# EAGLE design LowLevelv3_1 (EAGLE 9.6.2)

## Sheet 1 of 3
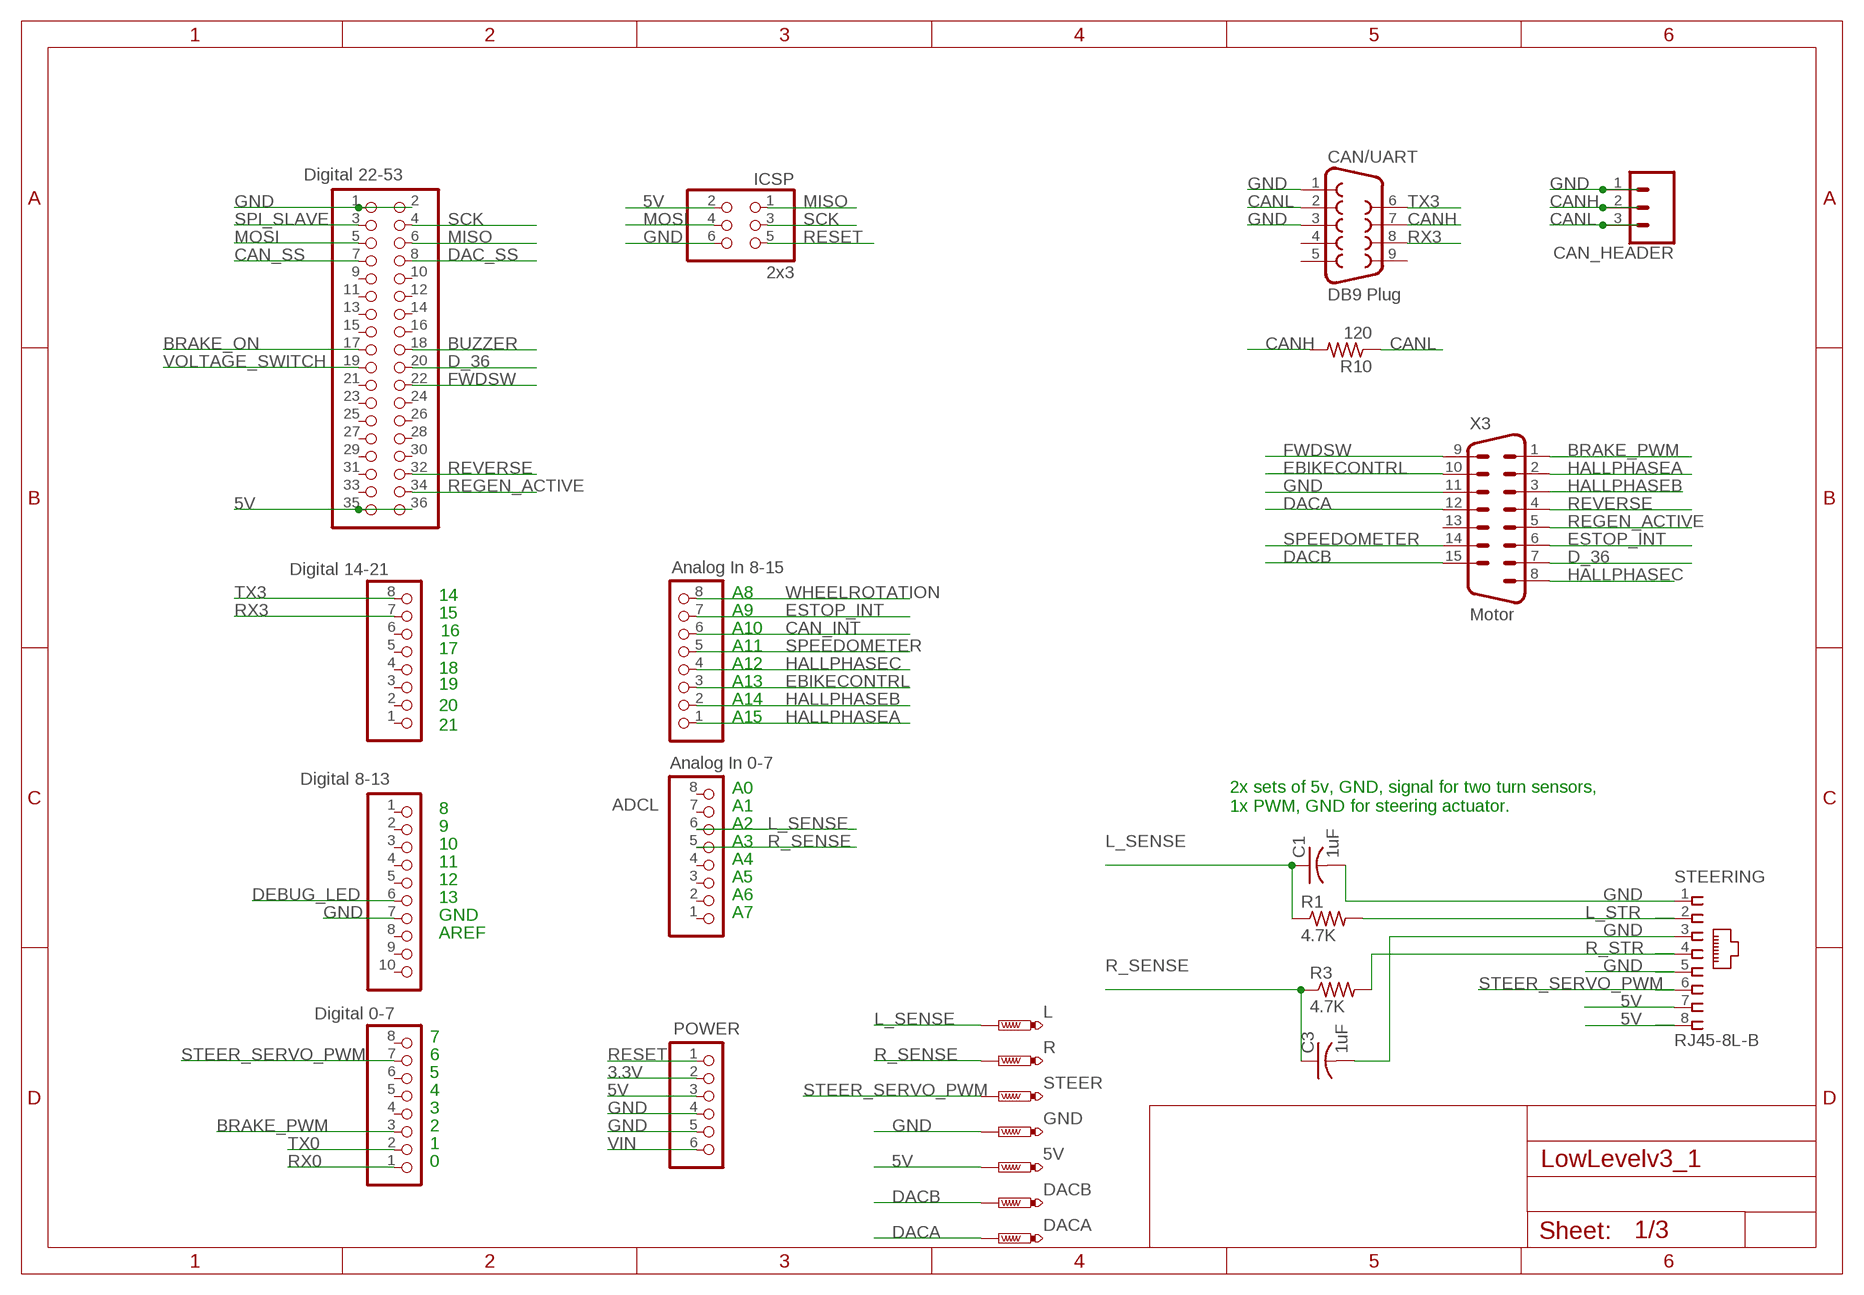
[diagram p0: schematic, sheet 1]

### Parts
5V  PTR1PAD1-17  [P1-17]
ADCH  Analog In 8-15  PINHD-1X8  [1X08]
ADCL  Analog In 0-7  PINHD-1X8  [1X08]
C1  1uF  C-USC1206  [C1206]
C3  1uF  C-USC1206  [C1206]
CAN/UART  DB9 Plug  DB9FEMALE  [DB9]
CAN_HEADER  CONN_03-SCREW-5MM  [SCREWTERMINAL-5MM-3]
DACA  PTR1PAD1-17  [P1-17]
DACB  PTR1PAD1-17  [P1-17]
DIGITAL_0-7  Digital 0-7  PINHD-1X8  [1X08]
DIGITAL_8-13  Digital 8-13  PINHD-1X10  [1X10]
DIGITAL_14-21  Digital 14-21  PINHD-1X8  [1X08]
GND  PTR1PAD1-17  [P1-17]
ICSP  2x3  PINHD-2X3  [2X03]
L  PTR1PAD1-17  [P1-17]
MEGA_EXPANSION  Digital 22-53  PINHEAD_PINHD-2X18  [PINHEAD_2X18]
POWER  PINHD-1X6  [1X06]
R  PTR1PAD1-17  [P1-17]
R1  4.7K  R-US_R1206  [R1206]
R3  4.7K  R-US_R1206  [R1206]
R10  120  R-US_R1206  [R1206]
STEER  PTR1PAD1-17  [P1-17]
STEERING  RJ45-8L-B  [RJ45-NO-SHIELD]
X3  Motor  M15-182  [182-015-MALE]

### Nets
3.3V [Power]: POWER.2
5V [Power]: 5V.TP ICSP.2 MEGA_EXPANSION.35 MEGA_EXPANSION.36 POWER.3 STEERING.7 STEERING.8 ; also sheet 2,3
BRAKE_ON: MEGA_EXPANSION.17 ; also sheet 3
BRAKE_PWM: DIGITAL_0-7.3 X3.1
BUZZER: MEGA_EXPANSION.18 ; also sheet 2
CAN_INT: ADCH.6 ; also sheet 2
CAN_SS [SPI_Signals]: MEGA_EXPANSION.7 ; also sheet 2
CANH: CAN/UART.7 CAN_HEADER.2 R10.2 ; also sheet 2
CANL: CAN/UART.2 CAN_HEADER.3 R10.1 ; also sheet 2
D_36: MEGA_EXPANSION.20 X3.7
DAC_SS [SPI_Signals]: MEGA_EXPANSION.8 ; also sheet 2
DACA: DACA.TP X3.12 ; also sheet 2
DACB: DACB.TP X3.15 ; also sheet 2
DEBUG_LED: DIGITAL_8-13.6 ; also sheet 2
EBIKECONTRL: ADCH.3 X3.10
ESTOP_INT: ADCH.7 X3.6 ; also sheet 2
FWDSW: MEGA_EXPANSION.22 X3.9
GND [Power]: C1.2 C3.2 CAN/UART.1 CAN/UART.3 CAN_HEADER.1 DIGITAL_8-13.7 GND.TP ICSP.6 MEGA_EXPANSION.1 MEGA_EXPANSION.2 POWER.4 POWER.5 STEERING.1 STEERING.3 STEERING.5 X3.11 ; also sheet 2,3
HALLPHASEA: ADCH.1 X3.2
HALLPHASEB: ADCH.2 X3.3
HALLPHASEC: ADCH.4 X3.8
L_SENSE: ADCL.6 C1.1 L.TP R1.1
L_STR: R1.2 STEERING.2
MISO [SPI_Signals]: ICSP.1 MEGA_EXPANSION.6 ; also sheet 2
MOSI [SPI_Signals]: ICSP.4 MEGA_EXPANSION.5 ; also sheet 2
R_SENSE: ADCL.5 C3.1 R3.1 R.TP
R_STR: R3.2 STEERING.4
REGEN_ACTIVE: MEGA_EXPANSION.34 X3.5
RESET: ICSP.5 POWER.1 ; also sheet 2
REVERSE: MEGA_EXPANSION.32 X3.4
RX0: DIGITAL_0-7.1
RX3: CAN/UART.8 DIGITAL_14-21.7
SCK [SPI_Signals]: ICSP.3 MEGA_EXPANSION.4 ; also sheet 2
SPEEDOMETER: ADCH.5 X3.14
SPI_SLAVE [SPI_Signals]: MEGA_EXPANSION.3
STEER_SERVO_PWM: DIGITAL_0-7.7 STEER.TP STEERING.6
TX0: DIGITAL_0-7.2
TX3: CAN/UART.6 DIGITAL_14-21.8
VIN: POWER.6
VOLTAGE_SWITCH: MEGA_EXPANSION.19 ; also sheet 3
WHEELROTATION: ADCH.8 ; also sheet 2
Unconnected: ADCL.1 ADCL.2 ADCL.3 ADCL.4 ADCL.7 ADCL.8 CAN/UART.4 CAN/UART.5 CAN/UART.9 DIGITAL_0-7.4 DIGITAL_0-7.5 DIGITAL_0-7.6 DIGITAL_0-7.8 DIGITAL_8-13.1 DIGITAL_8-13.2 DIGITAL_8-13.3 DIGITAL_8-13.4 DIGITAL_8-13.5 DIGITAL_8-13.8 DIGITAL_8-13.9 DIGITAL_8-13.10 DIGITAL_14-21.1 DIGITAL_14-21.2 DIGITAL_14-21.3 DIGITAL_14-21.4 DIGITAL_14-21.5 DIGITAL_14-21.6 MEGA_EXPANSION.9 MEGA_EXPANSION.10 MEGA_EXPANSION.11 MEGA_EXPANSION.12 MEGA_EXPANSION.13 MEGA_EXPANSION.14 MEGA_EXPANSION.15 MEGA_EXPANSION.16 MEGA_EXPANSION.21 MEGA_EXPANSION.23 MEGA_EXPANSION.24 MEGA_EXPANSION.25 MEGA_EXPANSION.26 MEGA_EXPANSION.27 MEGA_EXPANSION.28 MEGA_EXPANSION.29 MEGA_EXPANSION.30 MEGA_EXPANSION.31 MEGA_EXPANSION.33 X3.13

### Notes on the sheet
- 14 | A8
- 15 | A9
- 16 | A10
- 17 | A11
- 18 | A12
- 19 | A13
- A14
- 20
- A15
- 21
- A0
- A1
- 2x sets of 5v, GND, signal for two turn sensors,
  1x PWM, GND for steering actuator.
- 8
- 9 | A2
- 10 | A3
- 11 | A4
- 12 | A5
- 13 | A6
- GND | A7
- AREF
- 7
- 6
- 5
- 4
- 3
- 2
- 1
- 0

## Sheet 2 of 3
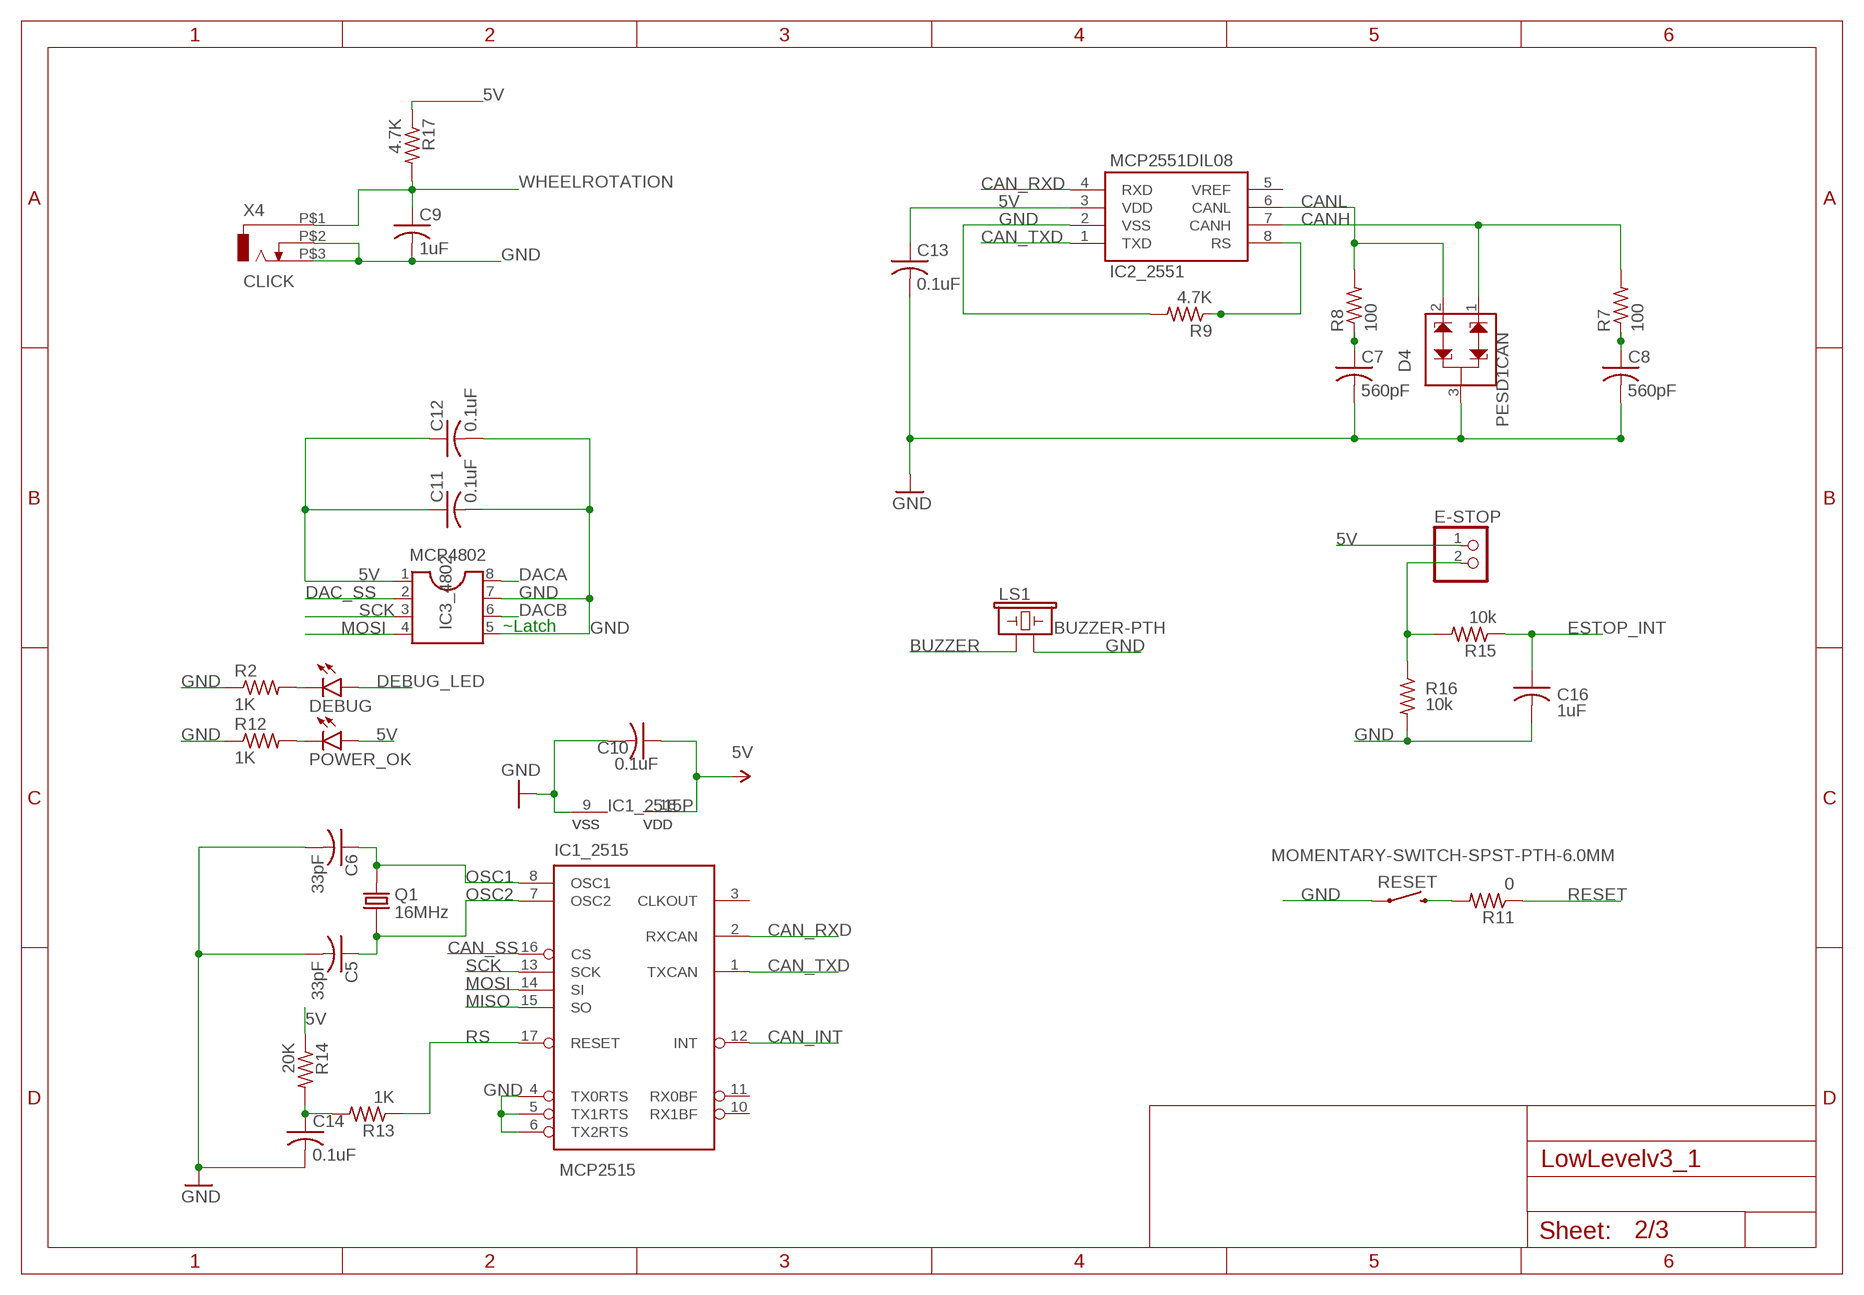
[diagram p1: schematic, sheet 2]

### Parts
C5  33pF  C-USC1206  [C1206]
C6  33pF  C-USC1206  [C1206]
C7  560pF  C-USC1206  [C1206]
C8  560pF  C-USC1206  [C1206]
C9  1uF  C-USC1206  [C1206]
C10  0.1uF  C-USC1206  [C1206]
C11  0.1uF  C-USC1206  [C1206]
C12  0.1uF  C-USC1206  [C1206]
C13  0.1uF  C-USC1206  [C1206]
C14  0.1uF  C-USC1206  [C1206]
C16  1uF  C-USC1206  [C1206]
D4  PESD1CAN  [SPARKFUN-DISCRETESEMI_SOT23-3]
DEBUG  LED3MM  [LED3MM]
E-STOP  PINHD-1X2  [1X02]
IC1_2515  MCP2515  MCP2515(MCP2510)P  [DIP18]
IC2_2551  MCP2551DIL08  [IC-PACKAGE_DIL08]
IC3_4802  MCP4802  DIL8  [DIL08]
LS1  BUZZER-PTH  [BUZZER-12MM]
POWER_OK  LED3MM  [LED3MM]
Q1  16MHz  ECS-160-20-46X  [XTAL_ECS-160-20-46X]
R2  1K  R-US_R1206  [R1206]
R7  100  R-US_R1206  [R1206]
R8  100  R-US_R1206  [R1206]
R9  4.7K  R-US_R1206  [R1206]
R11  0  R-US_R1206  [R1206]
R12  1K  R-US_R1206  [R1206]
R13  1K  R-US_R1206  [R1206]
R14  20K  R-US_R1206  [R1206]
R15  10k  R-US_R1206  [R1206]
R16  10k  R-US_R1206  [R1206]
R17  4.7K  R-US_R1206  [R1206]
RESET  MOMENTARY-SWITCH-SPST-PTH-6.0MM  [TACTILE_SWITCH_PTH_6.0MM]
X4  CLICK  ODO_JACK  [ODO_JACK]

### Nets
5V [Power]: C10.1 C11.1 C12.1 C13.1 E-STOP.1 IC1_2515.18(VDD) IC2_2551.3(VDD) IC3_4802.1 POWER_OK.A R14.1 R17.1 ; also sheet 1,3
BUZZER: LS1.+ ; also sheet 1
CAN_INT: IC1_2515.12(INT) ; also sheet 1
CAN_RXD: IC1_2515.2(RXCAN) IC2_2551.4(RXD)
CAN_SS [SPI_Signals]: IC1_2515.16(CS) ; also sheet 1
CAN_TXD: IC1_2515.1(TXCAN) IC2_2551.1(TXD)
CANH: D4.1 IC2_2551.7(CANH) R7.2 ; also sheet 1
CANL: D4.2 IC2_2551.6(CANL) R8.2 ; also sheet 1
DAC_SS [SPI_Signals]: IC3_4802.2 ; also sheet 1
DACA: IC3_4802.8 ; also sheet 1
DACB: IC3_4802.6 ; also sheet 1
DEBUG_LED: DEBUG.A ; also sheet 1
ESTOP_INT: C16.1 R15.1 ; also sheet 1
GND [Power]: C5.2 C6.2 C7.2 C8.2 C9.2 C10.2 C11.2 C12.2 C13.2 C14.2 C16.2 D4.3 IC1_2515.4(TX0RTS) IC1_2515.5(TX1RTS) IC1_2515.6(TX2RTS) IC1_2515.9(VSS) IC2_2551.2(VSS) IC3_4802.5 IC3_4802.7 LS1.- R2.1 R9.2 R12.1 R16.2 RESET.1 X4.P$2 X4.P$3 ; also sheet 1,3
MISO [SPI_Signals]: IC1_2515.15(SO) ; also sheet 1
MOSI [SPI_Signals]: IC1_2515.14(SI) IC3_4802.4 ; also sheet 1
N$1: R11.2 RESET.3
N$4: C14.1 R13.2 R14.2
N$5: DEBUG.K(C) R2.2
N$8: E-STOP.2 R15.2 R16.1
N$9: C7.1 R8.1
N$10: C8.1 R7.1
N$11: POWER_OK.K(C) R12.2
N$14: IC2_2551.8(RS) R9.1
OSC1 [Oscillator]: C6.1 IC1_2515.8(OSC1) Q1.2
OSC2 [Oscillator]: C5.1 IC1_2515.7(OSC2) Q1.1
RESET: R11.1 ; also sheet 1
RS: IC1_2515.17(RESET) R13.1
SCK [SPI_Signals]: IC1_2515.13(SCK) IC3_4802.3 ; also sheet 1
WHEELROTATION: C9.1 R17.2 X4.P$1 ; also sheet 1
Unconnected: IC1_2515.3(CLKOUT) IC1_2515.10(RX1BF) IC1_2515.11(RX0BF) IC2_2551.5(VREF)

### Notes on the sheet
- ~Latch

## Sheet 3 of 3
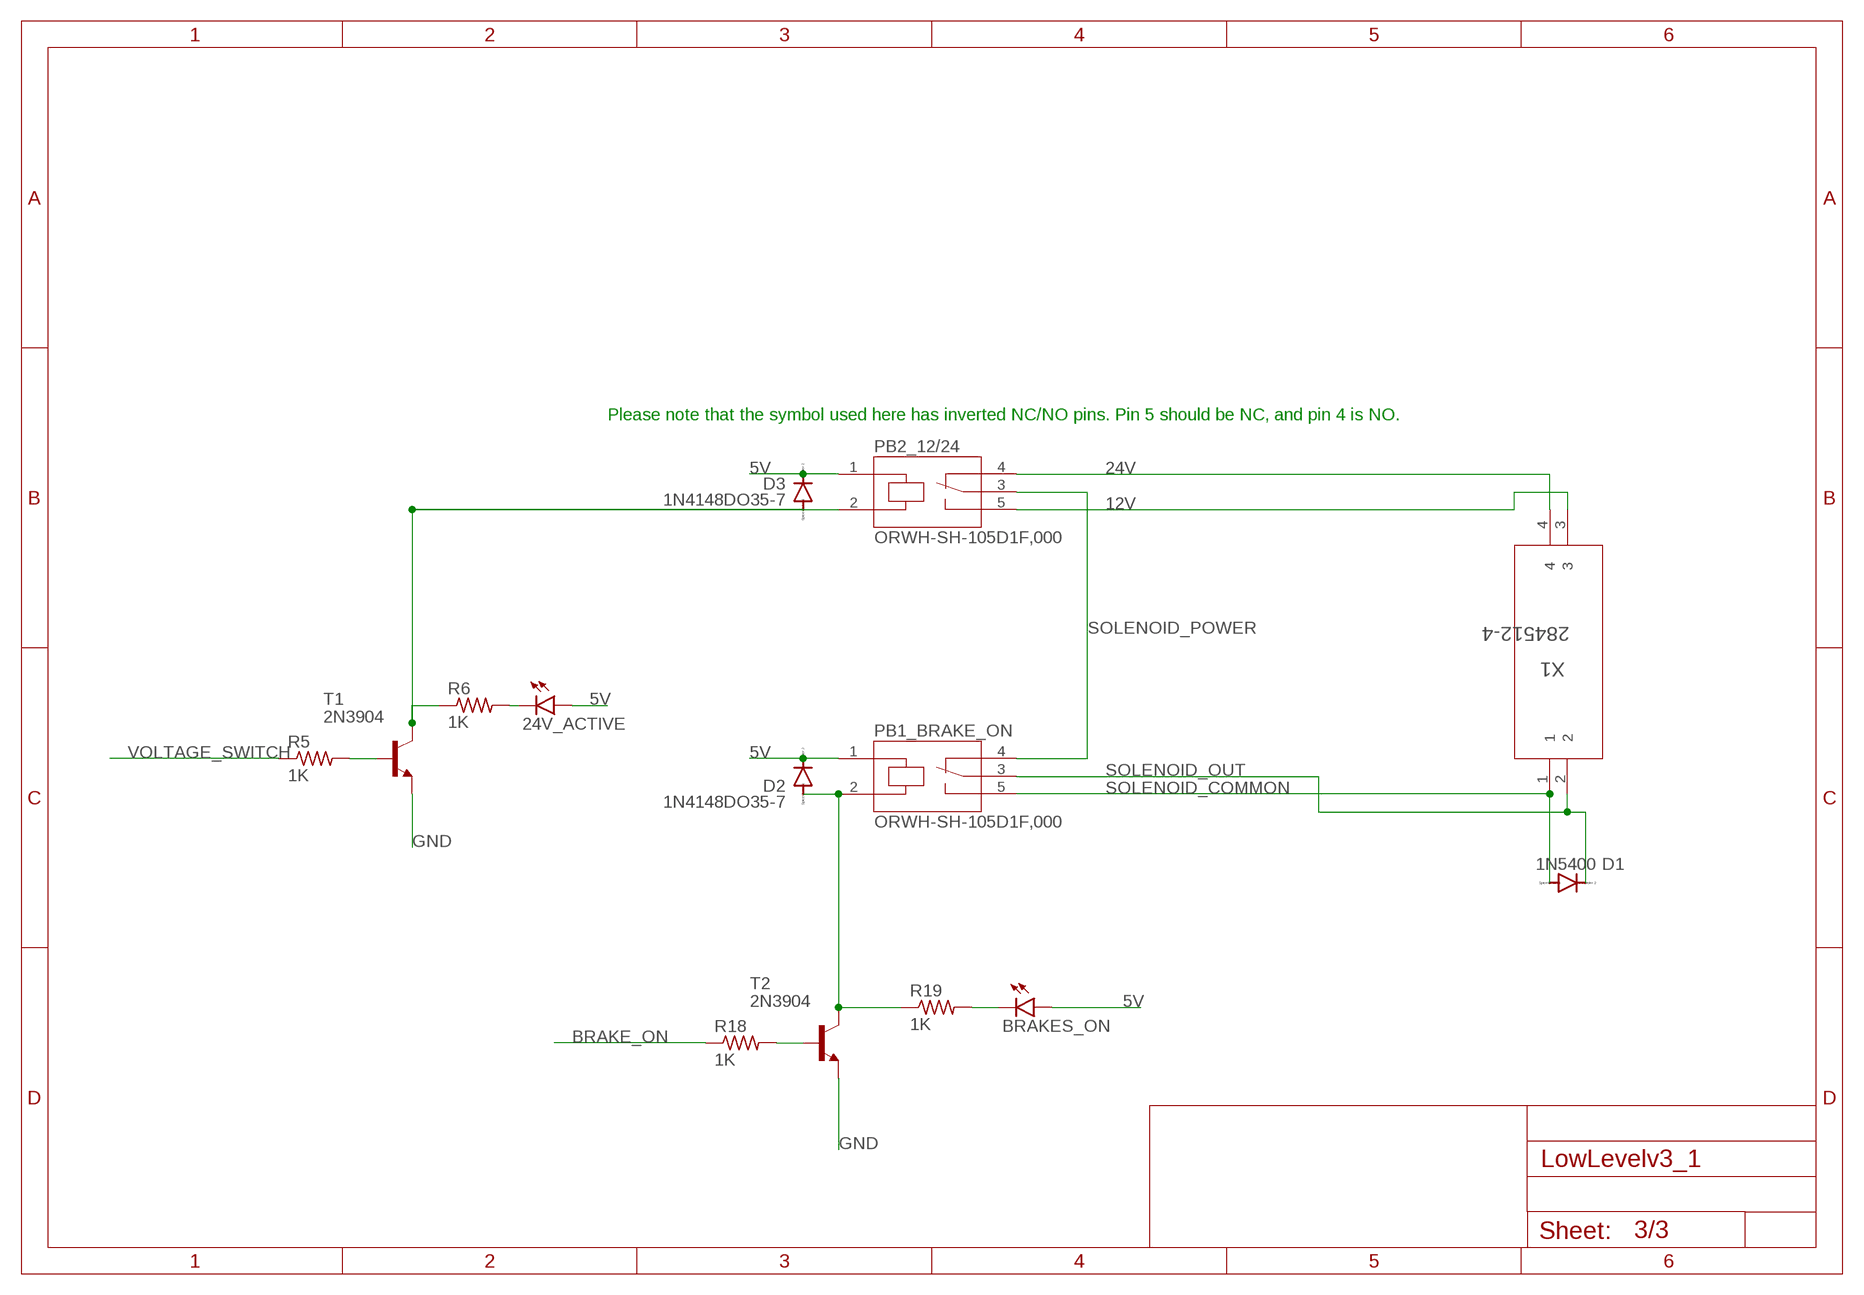
[diagram p2: schematic, sheet 3]

### Parts
24V_ACTIVE  LED3MM  [LED3MM]
BRAKES_ON  LED3MM  [LED3MM]
D1  1N5400  [DO201-15]
D2  1N4148DO35-7  [DO35-7]
D3  1N4148DO35-7  [DO35-7]
PB1_BRAKE_ON  ORWH-SH-105D1F,000  [TE_ORWH-SH-105D1F,000]
PB2_12/24  ORWH-SH-105D1F,000  [TE_ORWH-SH-105D1F,000]
R5  1K  R-US_R1206  [R1206]
R6  1K  R-US_R1206  [R1206]
R18  1K  R-US_R1206  [R1206]
R19  1K  R-US_R1206  [R1206]
T1  2N3904  [TO92]
T2  2N3904  [TO92]
X1  284512-4  [284512-4]

### Nets
5V [Power]: 24V_ACTIVE.A BRAKES_ON.A D2.C D3.C PB1_BRAKE_ON.1(C1) PB2_12/24.1(C1) ; also sheet 1,2
12V [High Current]: PB2_12/24.5(NO) X1.3
24V [High Current]: PB2_12/24.4(NC) X1.4
BRAKE_ON: R18.1 ; also sheet 1
GND [Power]: T1.3(E) T2.3(E) ; also sheet 1,2
N$2: R5.2 T1.2(B)
N$3: D3.A PB2_12/24.2(C2) R6.1 T1.1(C)
N$6: 24V_ACTIVE.K(C) R6.2
N$7: R18.2 T2.2(B)
N$12: D2.A PB1_BRAKE_ON.2(C2) R19.1 T2.1(C)
N$13: BRAKES_ON.K(C) R19.2
SOLENOID_COMMON [High Current]: D1.A PB1_BRAKE_ON.5(NO) X1.1
SOLENOID_OUT [High Current]: D1.C PB1_BRAKE_ON.3(C) X1.2
SOLENOID_POWER [High Current]: PB1_BRAKE_ON.4(NC) PB2_12/24.3(C)
VOLTAGE_SWITCH: R5.1 ; also sheet 1

### Notes on the sheet
- Please note that the symbol used here has inverted NC/NO pins. Pin 5 should be NC, and pin 4 is NO.

## Library data of the parts
5V DACA DACB GND L R STEER = testpad:PTR1: TEST PIN
24V_ACTIVE BRAKES_ON DEBUG POWER_OK = led:LED: LED OSRAM: - CHIPLED LG R971, LG N971, LY N971, LG Q971, LY Q971, LO R971, LY R971 LH N974, LH R974 LS Q976, LO Q976, LY Q976 LO Q996 - Hyper CHIPLED LW Q18S LB Q993, LB Q99A, LB R99A - SideLED LS A670, LO A670, LY A670, LG A670, LP A670 LB A673, LV A673, LT A673, LW A673 LH A674 LY A675 LS A676, LA A676, LO A676, LY A676, LW A676 LS A679, LY A679, LG A679 - Hyper Micro SIDELED® LS Y876, LA Y876, LO Y876, LY Y876 LT Y87S - SmartLED LW L88C, LW L88S LB L89C, LB L89S, LG L890 LS L89K, LO L89K, LY L89K LS L896, LA L896, LO L896, LY L896 - TOPLED LS T670, LO T670, LY T670, LG T670, LP T670 LSG T670, LSP T670, LSY T670, LOP T670, LYG T670 LG T671, LOG T671, LSG T671 LB T673, LV T673, LT T673, LW T673 LH T674 LS T676, LA T676, LO T676, LY T676, LB T676, LH T676, LSB T676, LW T676 LB T67C, LV T67C, LT T67C, LS T67K, LO T67K, LY T67K, LW E67C LS E67B, LA E67B, LO E67B, LY E67B, LB E67C, LV E67C, LT E67C LW T67C LS T679, LY T679, LG T679 LS T770, LO T770, LY T770, LG T770, LP T770 LB T773, LV T773, LT T773, LW T773 LH T774 LS E675, LA E675, LY E675, LS T675 LS T776, LA T776, LO T776, LY T776, LB T776 LHGB T686 LT T68C, LB T68C - Hyper Mini TOPLED® LB M676 - Mini TOPLED Santana® LG M470 LS M47K, LO M47K, LY M47K Source: http://www.osram.convergy.de LUXEON: - LUMILED® LXK2-PW12-R00, LXK2-PW12-S00, LXK2-PW14-U00, LXK2-PW14-V00 LXK2-PM12-R00, LXK2-PM12-S00, LXK2-PM14-U00 LXK2-PE12-Q00, LXK2-PE12-R00, LXK2-PE12-S00, LXK2-PE14-T00, LXK2-PE14-U00 LXK2-PB12-K00, LXK2-PB12-L00, LXK2-PB12-M00, LXK2-PB14-N00, LXK2-PB14-P00, LXK2-PB14-Q00 LXK2-PR12-L00, LXK2-PR12-M00, LXK2-PR14-Q00, LXK2-PR14-R00 LXK2-PD12-Q00, LXK2-PD12-R00, LXK2-PD12-S00 LXK2-PH12-R00, LXK2-PH12-S00 LXK2-PL12-P00, LXK2-PL12-Q00, LXK2-PL12-R00 Source: www.luxeon.com KINGBRIGHT: KA-3528ASYC Source: www.kingbright.com
ADCH ADCL DIGITAL_0-7 DIGITAL_14-21 = pinhead:PINHD-1X8: PIN HEADER
C1 C3 C5-C14 C16 = resistor:C-US: CAPACITOR, American symbol
CAN/UART = SparkFun-Connectors:DB9: DB9 Connector Standard DB9 (D-Sub 9) serial connector. Can be used for CAN bus as well as RS485 and RS232. Footprint production proven. Here is the female version connector we sell at SparkFun: 9 Pin Female Serial Connector - PCB Mount <https://www.sparkfun.com/products/429> (PRT-00429) This connector has been used on the following SparkFun products: SparkFun RS232 Shifter - SMD <https://www.sparkfun.com/products/449> (PRT-00449) SparkFun RS232 Shifter SMD (No DB9) <https://www.sparkfun.com/products/8780> (PRT-08780); PROD_ID: CONN-08194; SPICEPREFIX: X
CAN_HEADER = SparkFun-Connectors:CONN_03: Multi connection point. Often used as Generic Header-pin footprint for 0.1 inch spaced/style header connections On any of the 0.1 inch spaced packages, you can populate with these: Break Away Headers - Straight <https://www.sparkfun.com/products/116> (PRT-00116) Break Away Male Headers - Right Angle <https://www.sparkfun.com/products/553> (PRT-00553) Female Headers <https://www.sparkfun.com/products/115> (PRT-00115) Break Away Headers - Machine Pin <https://www.sparkfun.com/products/117> (PRT-00117) Break Away Female Headers - Swiss Machine Pin <https://www.sparkfun.com/products/743> (PRT-00743) Stackable Header - 3 Pin (Female, 0.1") <https://www.sparkfun.com/products/13875> (PRT-13875) For SCREWTERMINALS and SPRING TERMINALS visit here: Screw Terimnals on SparkFun.com <https://www.sparkfun.com/search/results?term=Screw+Terminals> (5mm/3.5mm/2.54mm spacing) This device is also useful as a general connection point to wire up your design to another part of your project. Our various solder wires solder well into these plated through hole pads. Hook-Up Wire - Assortment (Stranded, 22 AWG) <https://www.sparkfun.com/products/11375> (PRT-11375) Hook-Up Wire - Assortment (Solid Core, 22 AWG) <https://www.sparkfun.com/products/11367> (PRT-11367) View the entire wire category on our website here <https://www.sparkfun.com/categories/141> Special notes: Molex polarized connector foot print use with SKU : PRT-08232 with associated crimp pins and housings.; PROD_ID: CONN-10134; SF_SKU: PRT-08433
D1 = diode:1N5400: DIODE standard rectifier, 3 A, 50 V (Motorola)
D2 D3 = diode:1N4148: DIODE high speed (Philips)
D4 = elcanoParts:PESD1CAN: CAN bus ESD protection diode PESD1CAN is used to protect two CAN bus lines from ESD. Link to datasheet <http://www.nxp.com/documents/data_sheet/PESD1CAN-U.pdf> SparkFun Products: SparkFun CAN-BUS Shield <https://www.sparkfun.com/products/13262> '; SPICEPREFIX: J
DIGITAL_8-13 = pinhead:PINHD-1X10: PIN HEADER
E-STOP = pinhead:PINHD-1X2: PIN HEADER
IC1_2515 = SparkFun-IC-Comms:MCP2515(MCP2510): CAN controller with SPI interface The MCP2515 controller supercedes the MCP2510 while addressing all errata associated with it. The two devices are pin compatible, either can be used with this device. 18-pin package SOIC Simple SPI interface to any MCU. One-shot mode ensures message transmission is attempted only once Databyte filtering Start-of-Frame (SOF) output Low-power CMOS Technology Datasheet <http://www.sparkfun.com/datasheets/DevTools/Arduino/MCP2515.pdf> SparkFun Products CAN-BUS Shield <https://www.sparkfun.com/products/13262> (DEV-13262); PROD_ID: NA-XXXXX; SPICEPREFIX: X
IC2_2551 = elcanoParts:MCP2551: CAN transceiver; SPICEPREFIX: X
IC3_4802 = ic-package:DIL8: Dual In Line / Socket
ICSP = pinhead:PINHD-2X3: PIN HEADER
LS1 = SparkFun-Electromechanical:BUZZER: Buzzer Small round buzzers that operate around the audible 2kHz range. You can use these as speakers to create simple music or user interfaces. Variant Overview: PTH - Mini Speaker - PC Mount 12mm 2.048kHz <https://www.sparkfun.com/products/7950> PTH_KIT - Mini Speaker - PC Mount 12mm 2.048kHz <https://www.sparkfun.com/products/7950> KIT simplifies soldering by adding stop mask to one side of the pads. PTH_NO_SILK - Mini Speaker - PC Mount 12mm 2.048kHz <https://www.sparkfun.com/products/7950> No silkscreen indicator of buzzer outline. PTH_KIT_NO_SILK - Mini Speaker - PC Mount 12mm 2.048kHz <https://www.sparkfun.com/products/7950> KIT package w/o silkscreen SMD - Buzzer Audio Magnetic (CCV-084B16) SMD buzzer used on, e.g. the LilyPad Buzzer <https://www.sparkfun.com/products/8463> and RFID USB Reader <https://www.sparkfun.com/products/9963>. SMD_KIT - Buzzer Audio Magnetic (CCV-084B16) SMD Buzzer with elongated pins to make soldering easier. Used on the SparkFun Simon Says - Surface Mount Soldering Kit <https://www.sparkfun.com/products/10935>.; PROD_ID: COMP-08253; SF_SKU: COM-07950
MEGA_EXPANSION = elcanoParts:PINHEAD_PINHD-2X18: PIN HEADER
PB1_BRAKE_ON PB2_12/24 = elcanoParts:ORWH-SH-105D1F,000: General Purpose Relay, ORWH Series, Power, Non Latching, SPDT, 5 VDC, 10 A; DESCRIPTION: General Purpose Relay, ORWH Series, Power, Non Latching, SPDT, 5 VDC, 10 A; DIGI-KEY_PART_NUMBER: PB2032-ND; DIGI-KEY_PURCHASE_URL: https://www.digikey.com/product-detail/en/te-connectivity-potter-brumfield-relays/ORWH-SH-105D1F,000/PB2032-ND/4925028?utm_source=snapeda&utm_medium=aggregator&utm_campaign=symbol; MF: TE; MP: ORWH-SH-105D1F,000; PACKAGE: None
POWER = pinhead:PINHD-1X6: PIN HEADER
Q1 = elcanoParts:ECS-160-20-46X: QUARTZ CRYSTAL T/H; DESCRIPTION: Crystal 16MHz ±30ppm _Tol_ ±50ppm _Stability_ 20pF FUND 50Ohm; DIGI-KEY_PART_NUMBER: XC1759-ND; DIGI-KEY_PURCHASE_URL: https://www.digikey.com/product-detail/en/ecs-inc/ECS-160-20-46X/XC1759-ND/2676589?utm_source=snapeda&utm_medium=aggregator&utm_campaign=symbol; MF: ECS Inc.; MP: ECS-160-20-46X; PACKAGE: HC46/X ECS International; SPICEPREFIX: B
R1-R3 R5-R19 = resistor:R-US_: RESISTOR, American symbol
RESET = SparkFun-Switches:MOMENTARY-SWITCH-SPST: Momentary Switch (Pushbutton) - SPST Normally-open (NO) SPST momentary switches (buttons, pushbuttons). Variants PTH-12MM - 12mm square, through-hole Momentary Pushbutton Switch - 12mm Square <https://www.sparkfun.com/products/9190> (COM-09190) PTH-6.0MM, PTH-6.0MM-KIT - 6.0mm square, through-hole Mini Pushbutton Switch <https://www.sparkfun.com/products/97> (COM-00097) KIT package intended for soldering kit's - only one side of pads' copper is exposed. PTH-RIGHT-ANGLE-KIT - Right-angle, through-hole Right Angle Tactile Button <https://www.sparkfun.com/products/10791> - Used on SparkFun BigTime Watch Kit <https://www.sparkfun.com/products/11734> SMD-12MM - 12mm square, surface-mount Tactile Button - SMD (12mm) <https://www.sparkfun.com/products/12993> (COM-12993) Used on SparkFun PicoBoard <https://www.sparkfun.com/products/11888> SMD-4.5MM - 4.5mm Square Trackball Switch Used on SparkFun Blackberry Trackballer Breakout <https://www.sparkfun.com/products/13169> SMD-4.6MMX2.8MM - 4.60mm x 2.80mm, surface mount Used on SparkFun SAMD21 Mini Breakout <https://www.sparkfun.com/products/13664> SMD-5.2MM, SMD-5.2-REDUNDANT - 5.2mm square, surface-mount Mini Pushbutton Switch - SMD <https://www.sparkfun.com/products/8720> (COM-08720) Used on Arduino Pro Mini <https://www.sparkfun.com/products/11114> REDUNDANT package connects both switch circuits together SMD-6.0X3.5MM - 6.0 x 3.5mm, surface mount Momentary Reset Switch SMD <https://www.sparkfun.com/products/8229> (COM-08229) SMD-6.2MM-TALL - 6.2mm square, surface mount Tactile Button - SMD (6mm) <https://www.sparkfun.com/products/12992> Used on SparkFun Digital Sandbox <https://www.sparkfun.com/products/12651> SMD-RIGHT-ANGLE - Right-angle, surface mount Used on SparkFun Block for Intel® Edison - Arduino <https://www.sparkfun.com/products/13036>; PROD_ID: SWCH-08441; SF_SKU: COM-00097
STEERING = elcanoParts:RJ45: CORCOM Modular RJ Jacks No Shield Source: www.tycoelectronics.com .. ENG_DS_1654001_1099_RJ_L_0507.pdf; MF: TYCO ELECTRONICS; MPN: RJ45-8L-B; OC_FARNELL: 1279843; OC_NEWARK: 52K4445
T1 T2 = transistor:2N3904: NPN TRANSISTOR
X1 = elcanoParts:284512-4; MANUFACTURER_PART_NUMBER: 2845124; VENDOR: TE Connectivity
X3 = con-subd:M15: SUB-D; OC_FARNELL: unknown; OC_NEWARK: unknown
X4 = elcanoParts:ODO_JACK

## Net classes
0 default: width 0.254 mm, drill 0.305 mm, clearance 0.254 mm
1 Power: width 0.508 mm, drill 0.305 mm, clearance 0.254 mm
2 High Current: width 0.508 mm, drill 0.305 mm, clearance 0.508 mm
3 SPI_Signals: width 0.254 mm, clearance 0.254 mm
4 Oscillator: width 0.254 mm, clearance 0.508 mm

## Board
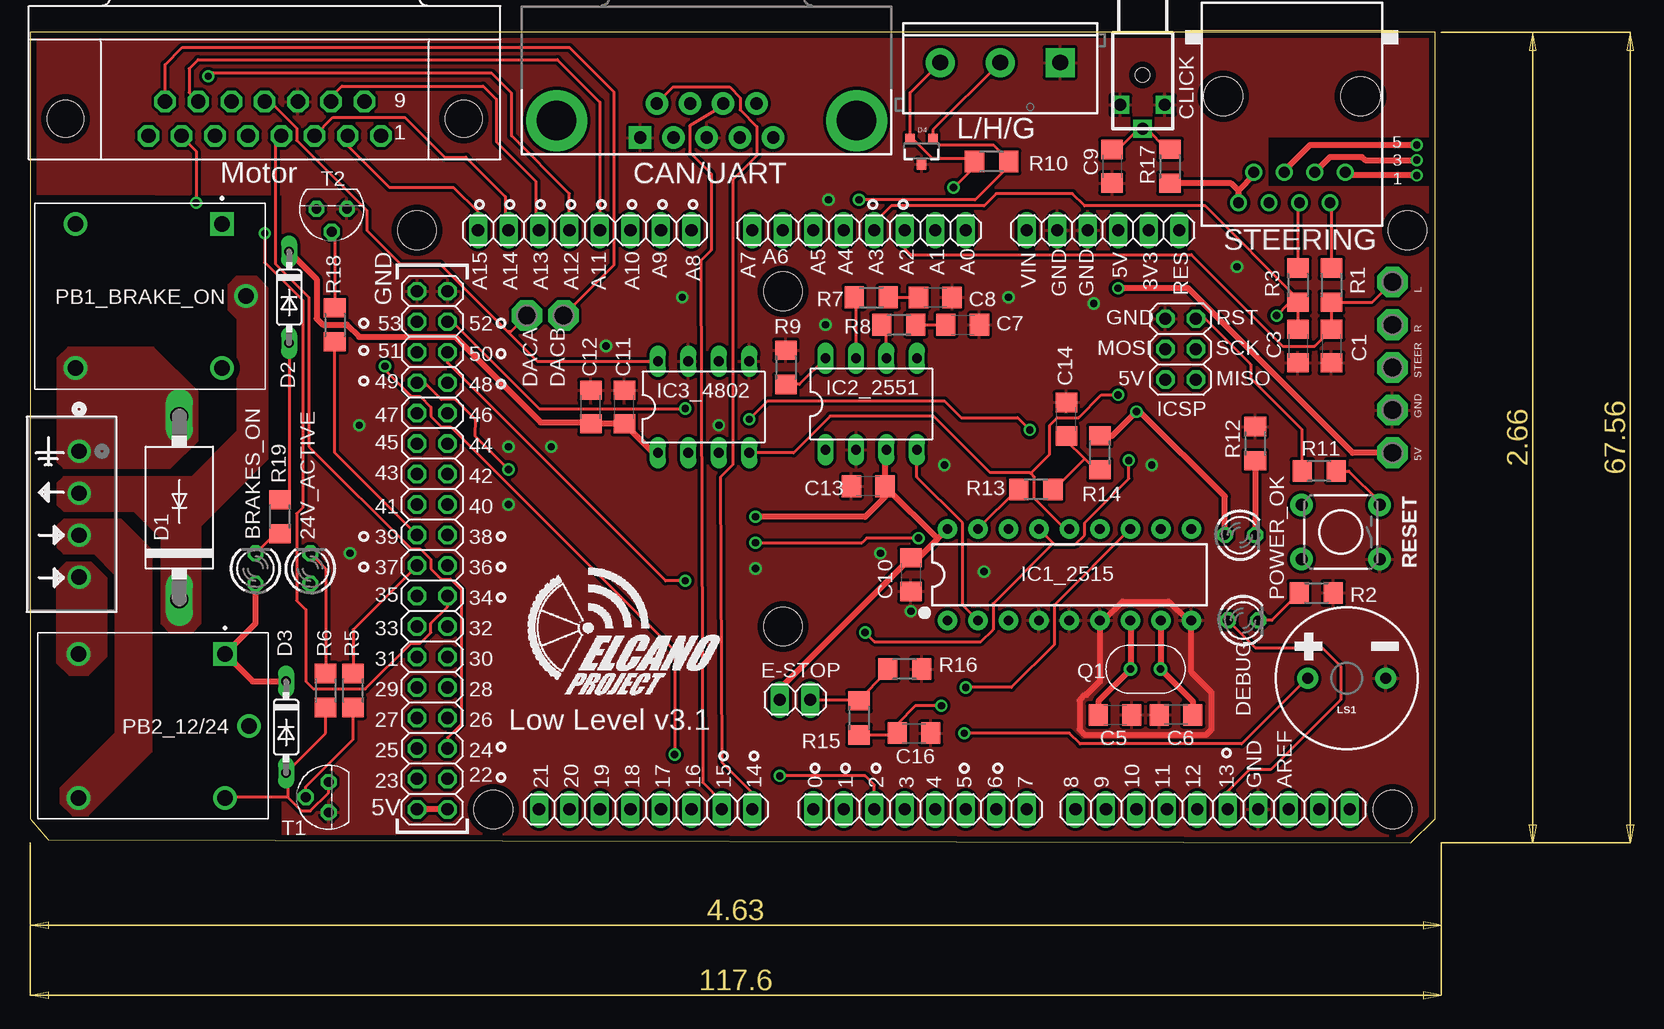
[diagram p3: board, top side]
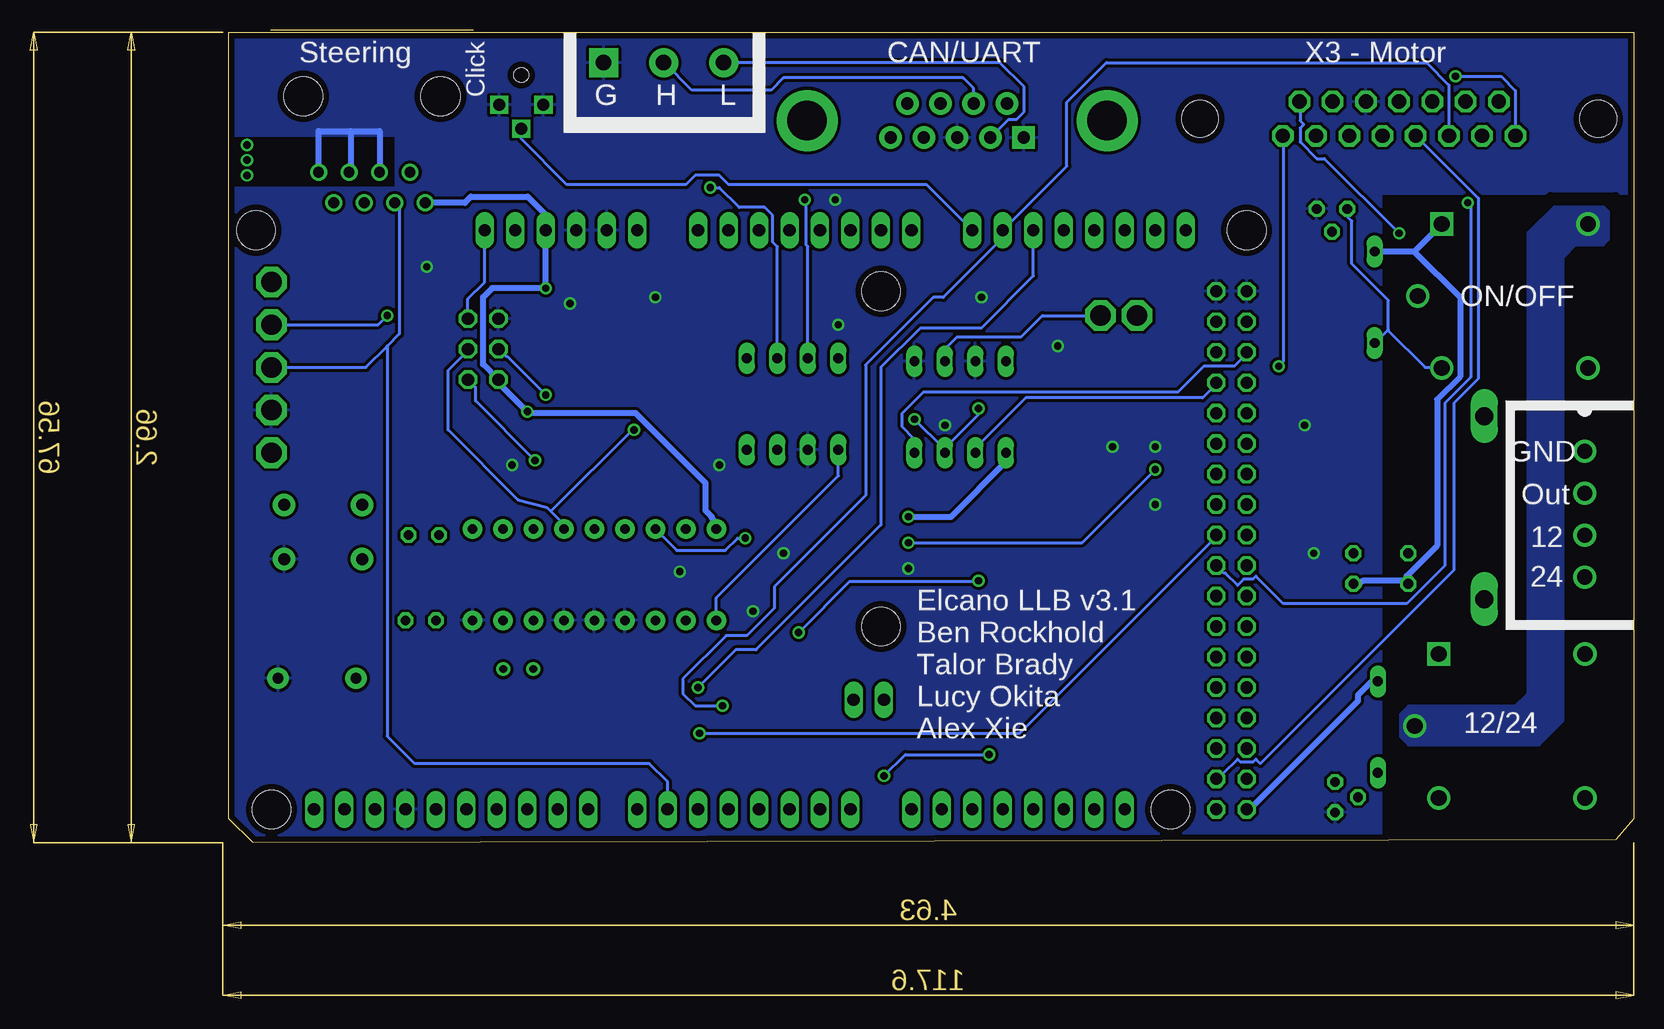
[diagram p4: board, bottom side, seen from below]

Size 117.09 x 67.56 mm. Coordinates in mm from the lower left corner, seen from the top.
Outline: 0,2.03 1.52,0.25 115.06,0 117.09,2.03 117.09,67.56 0,67.56 0,2.03
Copper layers (1*16): Top 0.035mm / dielectric 1.5mm / Bottom 0.035mm
Design rules "default *": minimum track width 10mil, minimum drill 24mil, track to track 8mil, track to pad 8mil, pad to pad 8mil, via to via 8mil, smd to smd 8mil, copper to edge 20mil, drill to drill 8mil, minimum pad ring 10mil, minimum via ring 8mil, stop-mask expansion 4mil, vias tented up to drill 0mil, thermal gap 10mil
Holes 3.2 mm at 38.61,2.79 113.54,2.79 32.26,51.05 114.81,51.05 62.74,45.97 62.74,18.03
tRestrict: area 0,1.7 to 20.6,53.6
bRestrict: area 0,7.1 to 20.3,53.8

### Footprints (pad centres in the part's own frame; a part is rotated, then mirrored left to right if it is on the bottom)
P1-17 = drill 1.702 pad 2.54 octagon: TP 0,0
LED3MM = drill 0.813 octagon: A -1.27,0; K 1.27,0
1X08 = drill 1.016 long: 1 -8.89,0; 2 -6.35,0; 3 -3.81,0; 4 -1.27,0; 5 1.27,0; 6 3.81,0; 7 6.35,0; 8 8.89,0
C1206 = smd 1.6 x 1.8: 1 -1.4,0; 2 1.4,0
DB9 = drill 1.016 pad 1.88 square: 1 -5.54,-1.42 | drill 1.016 pad 1.88: 2 -2.77,-1.42; 3 0,-1.42; 4 2.77,-1.42; 5 5.54,-1.42; 6 -4.15,1.42; 7 -1.38,1.42; 8 1.38,1.42; 9 4.15,1.42 | drill 3.302 pad 5.08: G1 -12.5,0; G2 12.5,0
SCREWTERMINAL-5MM-3 = drill 1.3 pad 2.413 square: 1 0,0 | drill 1.3 pad 2.413: 2 5,0; 3 10,0
DO201-15 = drill 1.499 long: A 7.62,0; C -7.62,0
DO35-7 = drill 0.813 long: A 3.81,0; C -3.81,0
SPARKFUN-DISCRETESEMI_SOT23-3 = smd 0.8 x 0.9: 1 -0.95,-1; 2 0.95,-1; 3 0,1.1
1X10 = drill 1.016 long: 1 -11.43,0; 2 -8.89,0; 3 -6.35,0; 4 -3.81,0; 5 -1.27,0; 6 1.27,0; 7 3.81,0; 8 6.35,0; 9 8.89,0; 10 11.43,0
1X02 = drill 1.016 long: 1 -1.27,0; 2 1.27,0
DIP18 = drill 0.813 pad 1.626: 1 -10.16,-3.81; 2 -7.62,-3.81; 3 -5.08,-3.81; 4 -2.54,-3.81; 5 0,-3.81; 6 2.54,-3.81; 7 5.08,-3.81; 8 7.62,-3.81; 9 10.16,-3.81; 10 10.16,3.81; 11 7.62,3.81; 12 5.08,3.81; 13 2.54,3.81; 14 0,3.81; 15 -2.54,3.81; 16 -5.08,3.81; 17 -7.62,3.81; 18 -10.16,3.81
IC-PACKAGE_DIL08 = drill 0.813 long: 1 -3.81,-3.81; 2 -1.27,-3.81; 3 1.27,-3.81; 4 3.81,-3.81; 5 3.81,3.81; 6 1.27,3.81; 7 -1.27,3.81; 8 -3.81,3.81
DIL08 = drill 0.813 long: 1 -3.81,-3.81; 2 -1.27,-3.81; 3 1.27,-3.81; 4 3.81,-3.81; 5 3.81,3.81; 6 1.27,3.81; 7 -1.27,3.81; 8 -3.81,3.81
2X03 = drill 1.016 octagon: 1 -2.54,-1.27; 2 -2.54,1.27; 3 0,-1.27; 4 0,1.27; 5 2.54,-1.27; 6 2.54,1.27
BUZZER-12MM = drill 0.9 pad 1.778: + 3.25,0; - -3.25,0
PINHEAD_2X18 = drill 1.016 octagon: 1 -21.59,-1.27; 2 -21.59,1.27; 3 -19.05,-1.27; 4 -19.05,1.27; 5 -16.51,-1.27; 6 -16.51,1.27; 7 -13.97,-1.27; 8 -13.97,1.27; 9 -11.43,-1.27; 10 -11.43,1.27; 11 -8.89,-1.27; 12 -8.89,1.27; 13 -6.35,-1.27; 14 -6.35,1.27; 15 -3.81,-1.27; 16 -3.81,1.27; 17 -1.27,-1.27; 18 -1.27,1.27; 19 1.27,-1.27; 20 1.27,1.27; 21 3.81,-1.27; 22 3.81,1.27; 23 6.35,-1.27; 24 6.35,1.27; 25 8.89,-1.27; 26 8.89,1.27; 27 11.43,-1.27; 28 11.43,1.27; 29 13.97,-1.27; 30 13.97,1.27; 31 16.51,-1.27; 32 16.51,1.27; 33 19.05,-1.27; 34 19.05,1.27; 35 21.59,-1.27; 36 21.59,1.27
TE_ORWH-SH-105D1F,000 = drill 1.3 square: 1 0,0 | drill 1.3: 2 0,12; 3 -2,6; 4 12.2,0; 5 12.2,12
1X06 = drill 1.016 long: 1 -6.35,0; 2 -3.81,0; 3 -1.27,0; 4 1.27,0; 5 3.81,0; 6 6.35,0
XTAL_ECS-160-20-46X = drill 0.63 pad 1.03: 1 -1.25,0; 2 1.25,0
R1206 = smd 1.6 x 1.803: 1 -1.422,0; 2 1.422,0
TACTILE_SWITCH_PTH_6.0MM = drill 1.016 pad 1.88: 1 -3.251,2.261; 2 3.251,2.261; 3 -3.251,-2.261; 4 3.251,-2.261
RJ45-NO-SHIELD = drill 0.9 pad 1.4: 1 -4.445,6.35; 2 -3.175,8.89; 3 -1.905,6.35; 4 -0.635,8.89; 5 0.635,6.35; 6 1.905,8.89; 7 3.175,6.35; 8 4.445,8.89 | hole 3.251: -5.715,0; 5.715,0
TO92 = drill 0.813 octagon: 1 1.27,0; 2 0,1.905; 3 -1.27,0
284512-4 = drill 1.27 pad 1.778: 1 0,0; 2 3.505,0; 3 7.01,0; 4 10.49,0
182-015-MALE = drill 1.194 pad 1.524 octagon: 1 -9.69,10.923; 2 -6.921,10.923; 3 -4.153,10.923; 4 -1.384,10.923; 5 1.384,10.923; 6 4.153,10.923; 7 6.921,10.923; 8 9.69,10.923; 9 -8.306,8.08; 10 -5.537,8.08; 11 -2.769,8.08; 12 0,8.08; 13 2.769,8.08; 14 5.537,8.08; 15 8.306,8.08 | hole 3.048: -16.599,9.501; 16.599,9.501
ODO_JACK = drill 1 square: P$1 4.5,0; P$2 2.5,1.85; P$3 2.5,-1.85 | hole 1.2: 0,0

### Placement (x,y rotation side)
5V  113.54,32.51 0 top
24V_ACTIVE  23.37,22.86 90 top
ADCH  46.23,51.05 0 top
ADCL  69.09,51.05 0 top
BRAKES_ON  18.8,22.86 90 top
C1  108.46,41.4 270 top
C3  105.66,41.4 270 top
C5  90.42,10.67 0 top
C6  95.5,10.67 180 top
C7  77.72,43.18 0 top
C8  75.44,45.47 0 top
C9  90.17,56.39 270 top
C10  73.41,22.35 270 top
C11  49.53,36.32 90 top
C12  46.74,36.32 90 top
C13  69.85,29.72 180 top
C14  86.36,35.31 90 top
C16  73.66,9.14 0 top
CAN/UART  56.39,60.2 0 top
CAN_HEADER  85.85,65.02 180 top
D1  12.45,27.94 90 top
D2  21.59,45.47 270 top
D3  21.34,9.65 270 top
D4  74.3,57.66 180 top
DACA  41.4,43.94 0 top
DACB  44.45,43.94 0 top
DEBUG  101.09,18.54 0 top
DIGITAL_0-7  74.17,2.79 0 top
DIGITAL_8-13  98.55,2.79 0 top
DIGITAL_14-21  51.31,2.79 0 top
E-STOP  63.75,11.94 0 top
GND  113.54,36.07 0 top
IC1_2515  86.61,22.35 0 top
IC2_2551  70.1,36.58 0 top
IC3_4802  56.13,36.32 0 top
ICSP  95.89,41.15 90 top
L  113.54,46.74 0 top
LS1  109.73,13.72 180 top
MEGA_EXPANSION  33.53,24.38 270 top
PB1_BRAKE_ON  16,51.56 180 top
PB2_12/24  16.26,15.75 180 top
POWER  89.41,51.05 180 top
POWER_OK  100.84,25.65 0 top
Q1  92.96,14.48 0 top
R  113.54,43.18 0 top
R1  108.46,46.48 90 top
R2  107.19,20.83 180 top
R3  105.66,46.48 90 top
R5  26.92,12.7 270 top
R6  24.64,12.7 90 top
R7  70.1,45.47 180 top
R8  72.39,43.18 180 top
R9  62.99,39.62 90 top
R10  80.14,56.77 0 top
R11  107.44,30.99 0 top
R12  102.11,33.27 270 top
R13  83.82,29.46 0 top
R14  89.15,32.51 270 top
R15  69.09,10.41 90 top
R16  72.9,14.48 0 top
R17  95,56.39 90 top
R18  25.4,43.18 90 top
R19  20.83,27.18 270 top
RESET  109.22,25.91 180 top
STEER  113.54,39.62 0 top
STEERING  105.16,62.23 180 top
T1  24.89,3.81 90 top
T2  25.15,52.83 180 top
X1  4.09,32.64 270 top
X3  19.56,69.85 180 top
X4  92.71,64.01 270 top

### Tracks (layer width: path | path; a pad name or v marks a point on that pad's centre or on a via)
5V  (via drill 0.61)
  Top 0.508: R14.1 89.15,33.91 90.17,33.91 v92.2,35.94 92.5,35.94 99.57,28.87 POWER_OK.A | MEGA_EXPANSION.36 MEGA_EXPANSION.35 | D3.C 18.54,13.46 PB2_12/24.1 18.8,18.29 BRAKES_ON.A | IC2_2551.3 71.25,32.64 C13.1 | IC1_2515.18 75.63,25.34 | 75.63,25.34 74.17,23.88 73.41,23.88 C10.1 73.28,23.62 62.48,12.83 E-STOP.1 | 75.63,25.34 71.37,29.59 C13.1 | IC3_4802.1 51.94,32.51 49.66,34.8 C11.1 C12.1 46.61,35.05 42.55,35.05 35.43,42.16 27.43,42.16 26.42,43.18 24.38,43.18 23.88,43.69 23.88,46.99 D2.C | C13.1 71.25,28.83 69.6,27.18 v60.45,27.18 | STEERING.7 101.98,55.63 100.71,54.36 | STEERING.8 100.71,54.36 | 100.71,54.36 100.1,54.97 R17.1 | 5V.TP 110.23,32.51 96.51,46.23 v90.68,46.23
  Bottom 0.508: 24V_ACTIVE.A 22.86,21.59 22.61,21.84 19.05,21.84 BRAKES_ON.A 18.92,21.97 18.92,22.22 16.38,24.76 16.38,36.96 14.48,38.86 14.48,45.47 18.29,49.28 | MEGA_EXPANSION.35 32,2.79 22.99,11.81 22.99,12.32 21.84,13.46 D3.C | 18.29,49.28 D2.C | PB1_BRAKE_ON.1 18.29,49.28 | IC3_4802.1 52.32,31.75 56.9,27.18 v60.45,27.18 | IC1_2515.18 76.45,26.67 76.83,27.05 76.83,27.18 77.34,27.69 77.34,29.97 83.19,35.81 92.08,35.81 v92.2,35.94 94.61,38.35 ICSP.2 95.89,39.88 95.89,45.48 95.14,46.23 v90.68,46.23 POWER.3 90.68,52.34 92.18,53.85 96.9,53.85 97.41,53.34 STEERING.8
12V
  pour Top (isolate 0.305, no thermals): 7.62,26.92 2.79,26.92 2.29,26.42 2.29,24.64 2.79,24.13 5.33,24.13 7.11,22.35 7.11,9.14 2.54,4.57 2.54,3.3 3.56,2.29 4.83,2.29 10.16,7.62 10.16,24.38
24V
  pour Top (isolate 0.305, no thermals): 3.05,23.37 5.08,23.37 6.35,22.1 6.35,15.49 4.83,13.97 3.3,13.97 2.29,14.99 2.29,22.61
BRAKE_ON
  Top 0.254: R18.1 25.4,32.51 MEGA_EXPANSION.17
BRAKE_PWM  (via drill 0.61)
  Top 0.254: v53.72,7.37 53.72,16 35.05,34.67 34.29,34.67 33.4,35.56 33.4,36.32 32.51,37.21 31.75,37.21 29.59,39.37 v29.59,39.73 | DIGITAL_0-7.3 70.36,4.83 69.6,5.59 v62.48,5.59
  Bottom 0.254: v29.59,39.73 29.21,40.11 29.21,58.8 X3.1 | v62.48,5.59 60.71,7.37 v53.72,7.37
BUZZER  (via drill 0.61)
  Top 0.254: v77.85,9.14 86.61,9.14 87.5,8.26 100.97,8.26 106.43,13.72 LS1.+
  Bottom 0.254: MEGA_EXPANSION.18 35.18,25.27 35.18,25.15 51.18,9.14 v77.85,9.14
CAN_INT  (via drill 0.61)
  Top 0.254: IC1_2515.12 85.34,19.81 85.34,16.51 81.79,12.95 v77.98,12.95
  Bottom 0.254: v77.98,12.95 74.85,16.08 73.17,16.08 62.74,26.51 62.74,39.62 59.44,42.93 54.36,42.93 50.04,47.24 ADCH.6
CAN_RXD
  Top 0.254: IC2_2551.4 73.91,30.48 77.72,26.67 77.72,19.81 IC1_2515.2
CAN_SS  (via drill 0.61)
  Top 0.254: MEGA_EXPANSION.7 32.89,38.35 34.29,36.96 35.43,36.96 37.08,35.31 37.08,33.91 v39.88,31.12 | v74.04,25.4 69.72,25.4 69.34,25.02 v60.45,25.02
  Bottom 0.254: v60.45,25.02 45.97,25.02 v39.88,31.12 | v74.04,25.4 74.68,25.4 75.69,24.38 79.76,24.38 IC1_2515.16
CAN_TXD
  Bottom 0.254: IC1_2515.1 76.45,20.41 66.29,30.57 IC2_2551.1
CANH  (via drill 0.61)
  Top 0.254: CAN_HEADER.2 75.25,59.42 D4.1 75.74,58.17 80.26,58.17 81.56,56.87 R10.2 81.56,56.39 78.77,53.59 v69.09,53.59 | IC2_2551.7 68.83,45.31 R7.2
  Bottom 0.254: IC2_2551.7 68.83,49.69 68.96,49.82 68.96,53.59 v69.09,53.59 | CAN/UART.7 55.01,62.88 55.88,63.75 70.87,63.75 71.88,62.74 78.49,62.74 80.77,65.02 CAN_HEADER.2
CANL  (via drill 0.61)
  Top 0.254: CAN_HEADER.3 73.34,62.52 D4.2 73.6,58.66 75.23,57.02 78.46,57.02 R10.1 78.72,56.36 v76.96,54.61 | IC2_2551.6 71.37,42.77 R8.2
  Bottom 0.254: IC2_2551.6 71.37,49.69 71.75,50.07 71.75,52.29 72.42,52.96 74.55,52.96 76.2,54.61 v76.96,54.61 | CAN/UART.2 52.1,60.3 51.44,60.3 50.8,60.93 50.8,62.99 52.83,65.02 CAN_HEADER.3
D_36  (via drill 0.61)
  Top 0.254: v13.84,53.34 13.84,57.66 12.7,58.8 X3.7
  Bottom 0.254: MEGA_EXPANSION.20 34.16,22.48 34.04,22.48 33.02,21.46 32.51,21.97 31.75,21.97 31.5,22.22 29.21,19.94 18.92,19.94 15.75,23.11 15.75,36.65 13.59,38.81 13.59,53.09 v13.84,53.34
DAC_SS
  Bottom 0.254: IC3_4802.2 54.86,32.89 50.67,37.08 35.94,37.08 34.8,38.23 MEGA_EXPANSION.8
DACA
  Top 0.254: IC3_4802.8 42.29,40.13 39.81,42.61 | 39.81,42.61 34.16,48.26 30.86,48.26 28.07,51.05 28.07,52.7 22.23,58.55 22.23,59.56 20.07,61.72 19.56,61.72 X3.12 | DACA.TP 40.07,42.61 39.81,42.61
DACB
  Top 0.254: X3.15 11.25,64.85 12.7,66.29 44.96,66.29 48.64,62.61 48.64,48.13 DACB.TP
  Bottom 0.254: IC3_4802.6 57.4,41.15 56.39,42.16 51.05,42.16 49.28,43.94 DACB.TP
DEBUG_LED
  Top 0.254: DEBUG.A 102.11,16.26 107.7,16.26 109.22,14.73 109.22,11.94 103.38,6.1 101.6,6.1 99.82,4.32 DIGITAL_8-13.6
EBIKECONTRL
  Top 0.254: X3.10 25.09,62.18 25.98,63.07 37.77,63.07 38.86,61.98 38.86,58.42 42.16,55.12 42.16,51.31 ADCH.3
ESTOP_INT  (via drill 0.61)
  Top 0.254: R15.1 72.11,8.99 C16.1 72.26,9.91 73.78,11.43 v75.95,11.43
  Bottom 0.254: X3.6 15.4,63.16 17.27,65.02 43.94,65.02 47.24,61.72 47.24,56.39 ADCH.7 52.7,50.93 52.7,50.29 57.53,45.47 58.38,45.47 64.01,39.83 64.01,28.96 71.63,21.34 71.63,19.56 73.91,17.27 75.65,17.27 79.25,13.67 79.25,12.45 78.23,11.43 v75.95,11.43
FWDSW  (via drill 0.61)
  Top 0.254: MEGA_EXPANSION.22 34.8,19.68 33.4,18.29 33.4,17.53 32.51,16.64 31.75,16.64 27.94,12.83 23.62,12.83 22.99,13.46 22.99,19.43 22.23,20.19 22.23,27.43 22.73,27.94 22.73,45.21 19.56,48.39 v19.56,50.8
  Bottom 0.254: v19.56,50.8 25.78,57.02 26.42,57.02 27.81,58.42 27.81,59.56 27.56,59.82 27.56,59.94 27.81,60.2 27.81,61.72 X3.9
GND  (via drill 0.61)
  Top 0.508: STEERING.5 104.52,56.01 106.68,58.17 v115.57,58.17 | STEERING.3 108.33,57.15 111,57.15 111.25,56.9 v115.57,56.9 | v115.57,55.63 109.86,55.63 STEERING.1 | IC1_2515.6 89.15,13.46 88.02,12.33 87.91,12.33 87.46,11.88 87.46,9.45 87.91,9.01 92.96,9.01 98.02,9.01 98.47,9.45 98.47,12.53 96.77,14.22 IC1_2515.9 96.46,18.54 94.89,20.12 91.04,20.12 89.47,18.54 IC1_2515.6
  Bottom 0.508: STEERING.5 104.52,59.31 106.93,59.31 | STEERING.3 106.93,56.01 106.93,59.31 | STEERING.1 109.6,59.31 106.93,59.31
  other vias: 81.53,45.47 66.29,43.18 88.65,44.96 73.41,19.3 26.67,24.13 27.43,34.8 43.43,33.02 39.88,28.19 48.01,41.4 66.55,53.59 39.88,33.02 70.87,24.13 60.45,22.86 54.36,45.47 79.5,22.61 76.2,31.5 93.47,31.5 57.4,34.8 100.58,48.01
  pour Bottom (isolate 0.254): 0,54.1 21.08,54.1 21.08,0 117.6,0 117.6,54.61 103.12,54.61 103.12,58.93 117.6,58.93 117.6,67.56 0,67.56
  pour Top (isolate 0.254): 0,54.1 21.08,54.1 21.08,0 117.6,0 117.09,54.61 103.12,54.61 103.12,58.93 117.09,58.93 117.09,67.06 117.6,67.56 0,67.56
HALLPHASEA
  Top 0.254: ADCH.1 37.34,52.58 35.31,54.61 29.97,54.61 26.48,58.1 X3.2
HALLPHASEB
  Top 0.254: X3.3 25.24,60.45 31.24,60.45 34.54,57.15 36.32,57.15 39.62,53.85 39.62,51.31 ADCH.2
HALLPHASEC  (via drill 0.61)
  Top 0.254: ADCH.4 44.96,54.1 40.13,58.93 40.13,62.48 38.48,64.14 15.11,64.14 v14.86,63.88
  Bottom 0.254: v14.86,63.88 11.05,63.88 9.87,62.7 X3.8
L_SENSE
  Top 0.254: ADCL.6 72.9,49.53 73.41,49.02 96.77,49.02 104.39,41.4 107.06,41.4 C1.1 R1.1 111.86,45.06 L.TP
L_STR
  Top 0.254: STEERING.2 108.46,53.21 R1.2
MISO  (via drill 0.61)
  Top 0.254: v91.57,31.88 91.57,30.35 87.88,26.67 87.88,25.65 87.12,24.89 85.34,24.89 85.28,24.95 | IC1_2515.15 85.28,24.95 | MEGA_EXPANSION.6 34.8,40 52.96,21.84 v54.61,21.84 | 85.28,24.95 80.26,19.94 80.26,17.78 79.25,16.76 70.36,16.76 v69.6,17.53
  Bottom 0.254: ICSP.1 96.52,37.97 96.52,36.83 v91.57,31.88 | v54.61,21.84 54.61,21.79 65.33,21.79 v69.6,17.53
MOSI  (via drill 0.61)
  Top 0.254: IC3_4802.4 63.63,32.51 66.67,35.56 75.31,35.56 80.01,30.86 83.31,30.86 83.38,30.8 | 83.38,30.8 83.69,30.48 83.69,28.7 86.23,26.16 IC1_2515.14 | v90.68,37.34 89.28,37.34 87.38,35.43 85.6,35.43 84.96,34.8 84.96,32.38 83.38,30.8
  Bottom 0.254: MEGA_EXPANSION.5 32.64,40.51 32.64,40.39 33.27,39.75 35.81,39.75 37.97,37.59 59.18,37.59 60.96,35.81 60.96,34.67 59.94,33.66 IC3_4802.4 | ICSP.4 93.98,40.51 93.85,40.51 v90.68,37.34
N$1
  Top 0.254: R11.2 109.91,30.99 112.47,28.42 RESET.3
N$2
  Top 0.254: R5.2 26.92,8.64 22.99,4.7 T1.2
N$3
  Top 0.254: R6.1 24.64,9.14 D3.A 21.46,5.84 21.46,3.81 | T1.1 24.89,4.19 23.37,2.67 22.61,2.67 21.46,3.81 | 21.46,3.81 16.26,3.81 PB2_12/24.2
N$4
  Top 0.254: 87.88,32 89.15,30.73 R14.2 | 87.88,32 86.36,33.53 C14.1 | 87.88,32 85.34,29.46 R13.2
N$5
  Top 0.254: R2.2 103.48,18.54 DEBUG.K
N$6
  Top 0.254: R6.2 24.64,22.86 24V_ACTIVE.K
N$7
  Top 0.254: R18.2 25.4,50.67 T2.2
N$8
  Top 0.254: E-STOP.2 69.09,11.94 | 69.09,11.94 71.37,14.22 71.37,14.48 R16.1 | 69.09,11.94 R15.2
N$9
  Top 0.254: R8.1 C7.1
N$10
  Top 0.254: R7.1 C8.1
N$11
  Top 0.508: R12.2 POWER_OK.K
N$12
  Top 0.254: D2.A 21.59,29.36 R19.1
  Bottom 0.254: T2.1 23.88,52.2 23.5,51.82 23.5,48.26 20.45,45.21 20.45,42.8 20.51,42.74 | D2.A 20.51,42.74 | 20.51,42.74 17.4,39.62 16,39.62 PB1_BRAKE_ON.2
N$13
  Top 0.254: R19.2 20.42,25.76 BRAKES_ON.K
N$14
  Top 0.254: IC2_2551.8 64.11,38.2 R9.1
OSC1
  Top 0.508: IC1_2515.8 94.23,14.5 Q1.2 96.9,11.79 C6.1
OSC2
  Top 0.508: IC1_2515.7 91.71,18.52 Q1.1 89.02,11.79 C5.1
R_SENSE  (via drill 0.61)
  Top 0.254: ADCL.5 70.36,51.69 71.75,53.09 79.5,53.09 80.52,54.1 86.87,54.1 87.88,53.09 97.92,53.09 105.66,45.34 R3.1 105.66,44.96 | 105.66,44.96 C3.1 | v103.89,43.94 104.9,44.96 105.66,44.96
  Bottom 0.254: R.TP 104.65,43.18 v103.89,43.94
R_STR
  Top 0.254: STEERING.4 105.66,53.21 R3.2
REGEN_ACTIVE
  Bottom 0.254: MEGA_EXPANSION.34 34.42,5.71 34.29,5.71 33.02,6.99 32.77,6.73 31.75,6.73 31.5,6.99 31.11,6.6 14.99,22.73 14.99,36.65 12.95,38.68 12.95,53.72 X3.5
RESET
  Top 0.254: R11.1 106.02,34.44 101.73,38.73 101.73,39.88 97.92,43.69 ICSP.5
  Bottom 0.254: ICSP.5 97.16,45.34 95.76,46.74 POWER.1
REVERSE
  Top 0.254: MEGA_EXPANSION.32 34.8,8.76 35.94,9.91 35.94,21.08 35.05,21.97 34.29,21.97 33.4,22.86 33.4,23.62 32.51,24.51 31.75,24.51 23.24,33.02 23.24,45.47 20.45,48.26 20.45,58.42 20.83,58.8 X3.4
RS
  Top 0.254: IC1_2515.17 82.3,29.46 R13.1
RX3
  Top 0.254: DIGITAL_14-21.7 57.66,3.43 56.05,5.03 55.88,48.51 56.77,49.4 56.77,55.75 54.97,57.56 54.97,59.76 57.06,61 57.68,61.62 CAN/UART.8
SCK  (via drill 0.61)
  Top 0.254: v54.61,36.2 42.42,36.2 35.18,43.43 MEGA_EXPANSION.4 | v83.31,34.42 82.3,35.43 77.6,35.43 76.2,36.83 61.47,36.83 v59.94,35.31
  Bottom 0.254: ICSP.3 97.54,40.77 97.54,40.64 98.81,39.37 98.81,34.42 92.99,28.6 90.58,27.97 | IC1_2515.13 89.15,26.54 90.23,27.62 | 57.4,32.89 IC3_4802.3 | 57.4,32.89 54.61,35.69 v54.61,36.2 | 57.4,32.89 57.47,32.83 v59.94,35.31 | 90.23,27.62 83.44,34.42 v83.31,34.42 | 90.58,27.97 | 90.58,27.97 90.23,27.62
SOLENOID_COMMON
  pour Top (isolate 0.305, no thermals): 2.79,31.24 11.68,31.24 13.97,33.53 13.97,37.59 10.29,41.27 3.17,41.27 2.29,40.39 2.29,31.75
SOLENOID_OUT
  pour Top (isolate 0.305, no thermals): 2.79,27.69 8.64,27.69 10.92,25.4 10.92,18.29 11.68,17.53 13.46,17.53 14.22,18.29 14.22,26.42 19.81,32 19.81,46.23 18.8,47.24 17.27,47.24 16.51,46.48 16.51,44.45 17.27,43.69 17.27,34.29 13.46,30.48 2.79,30.48 2.29,29.97 2.29,28.19
SOLENOID_POWER
  pour Bottom (isolate 0.305, no thermals): 18.8,11.43 19.56,10.67 19.56,8.89 18.8,8.13 7.87,8.13 5.84,10.16 5.84,48.77 4.83,49.78 2.54,49.78 2.03,50.29 2.03,52.58 2.54,53.09 6.86,53.09 8.89,51.05 8.89,12.45 9.91,11.43
SPEEDOMETER
  Top 0.254: X3.14 13.27,62.53 13.27,64.53 14.01,65.28 43.94,65.28 47.5,61.72 ADCH.5
STEER_SERVO_PWM
  Bottom 0.254: DIGITAL_0-7.7 80.52,5.08 82.04,6.6 101.6,6.6 103.89,8.89 103.89,41.4 | STEERING.6 102.87,52.96 102.87,42.42 103.89,41.4 | STEER.TP 105.66,39.62 103.89,41.4
TX3
  Top 0.254: DIGITAL_14-21.8 60.2,4.19 57.66,6.72 57.52,30.47 58.55,31.5 58.55,55.24 60.58,57.28 60.58,59.69 59.18,61.09 59.18,62.1 58.29,62.99 53.59,62.99 52.32,61.72 CAN/UART.6
VOLTAGE_SWITCH
  Top 0.254: R5.1 26.92,17.78 MEGA_EXPANSION.19
WHEELROTATION
  Top 0.254: R17.2 94.74,57.81 93.04,59.51 X4.P$1 92.4,59.51 90.68,57.79 C9.1
  Bottom 0.254: ADCH.8 58.93,54.86 75.44,54.86 76.2,55.63 78.23,55.63 78.99,54.86 88.9,54.86 92.71,58.67 X4.P$1

### Text on the board
tNames: L/H/G | 5 / 3 / 1 | GND | A15 | A14 | A13 | A12 | A11 | A10 | A9 | A7 | A6 | A5 | A4 | A3 | A2 | A1 | A0 | VIN | GND | GND | 5V | 3V3 | RES | A8 | 53 | 52 | GND | RST | 51 | MOSI | SCK | 50 | 49 | 48 | 5V | MISO | 47 | 46 | 45 | 44 | 43 | 42 | 41 | 40 | 39 | 38 | 37 | 36 | 35 | 34 | 33 | 32 | 31 | 30 | 29 | 28 | 27 | 26 | Low Level v3.1 | 25 | 24 | 23 | 22 | 21 | 20 | 19 | 18 | 17 | 16 | 15 | 14 | 0 | 1 | 2 | 3 | 4 | 5 | 6 | 7 | 8 | 9 | 10 | 11 | 12 | 13 | GND | AREF | 5V
bNames: Click | X3 - Motor | CAN/UART | Steering | L | H | G | ON/OFF | GND | Out | 12 | 24 | 12/24 | Elcano LLB v3.1 / Ben Rockhold / Talor Brady / Lucy Okita / Alex Xie